# Altium schematic sheet buttons.SchDoc: Power Control Board
size A; CheckedBy: TunBra; DrawnBy: Iheb Wesleti; SheetNumber: 3; SheetTotal: 3
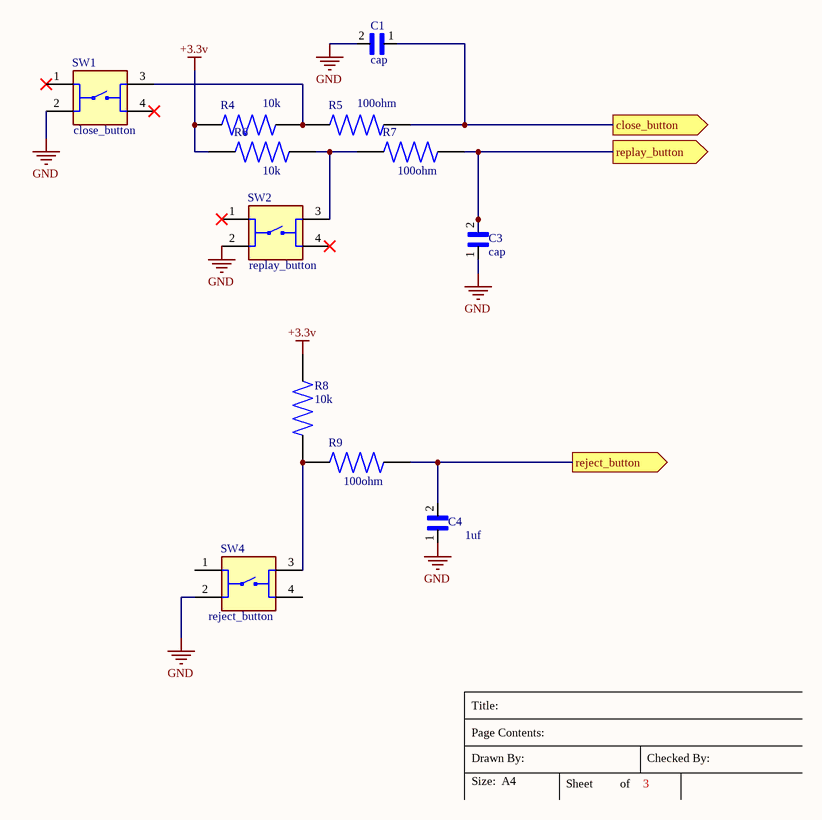
[diagram p0: buttons.SchDoc]

## Parts
C1  cap  [cap]
C3  cap  [cap]
C4  value 1uf  [cap]  (hidden comment: cap)
R4  value 10k  [resistance]  (hidden comment: resistance)
R5  value 100ohm  [resistance]  (hidden comment: resistance)
R6  value 10k  [resistance]  (hidden comment: resistance)
R7  value 100ohm  [resistance]  (hidden comment: resistance)
R8  value 10k  [resistance]  (hidden comment: resistance)
R9  value 100ohm  [resistance]  (hidden comment: resistance)
SW1  close_button  [push_button_pcb]
SW2  replay_button  [push_button_pcb]
SW4  reject_button  [push_button_pcb]

## Ports
close_button (out), reject_button (out), replay_button (out)

## Nets
+3.3v: R4.2 R6.2 R8.1
GND: C1.2 C3.1 C4.1 SW1.2 SW2.2 SW4.2
close_button: C1.1 R5.1 ; port close_button
reject_button: C4.2 R9.1 ; port reject_button
replay_button: C3.2 R7.1 ; port replay_button
NetR4_1: R4.1 R5.2 SW1.3
NetR6_1: R6.1 R7.2 SW2.3
NetR8_2: R8.2 R9.2 SW4.3

Not connected (* = marked no-connect by the designer): SW1 1* 4*; SW2 1* 4*; SW4 1 4

## Notes on the sheet
- Title:
- Size:
- Drawn By:
- Page Contents:
- A4
- Sheet
- of
- Checked By:
- 3

## Library data of the parts
C1 C3 C4 = cap: Lead Capacitor X7R_EIA_ with Capacitance: 0.10F and Rated Voltage: 1000Vdc; MF: Murata; MP: RDER73A104K5E1H03A; Price: None; SnapEDA_Link: https://www.snapeda.com/parts/RDER73A104K5E1H03A/Murata/view-part/4545952/?ref=snap; Package: Radial Murata; Availability: Unavailable
  C1 C3: Value: *
R4-R9 = resistance: MP: CBT50J5R1; MF: TE Connectivity / AMP; Price: None; Availability: In Stock; Package: Axial TE Connectivity / AMP; SnapEDA_Link: https://www.snapeda.com/parts/CBT50J5R1/TE+Connectivity+%252F+AMP/view-part/?ref=snap; Purchase-URL: https://pricing.snapeda.com/search/part/CBT50J5R1/?ref=eda; Check_prices: https://www.snapeda.com/parts/CBT50J5R1/TE+Connectivity+%252F+AMP/view-part/?ref=eda
SW1 SW2 SW4 = push_button: Switch Push Button OFF (ON) SPST Round Button 0.05A 24VDC Momentary Contact PC Pins Thru-Hole; MP: 1825910-6; MF: TE Connectivity; Value: *; Package: None; Check_prices: https://www.snapeda.com/parts/1825910-6/TE+Connectivity+ALCOSWITCH+Switches/view-part/?ref=eda; SnapEDA_Link: https://www.snapeda.com/parts/1825910-6/TE+Connectivity+ALCOSWITCH+Switches/view-part/?ref=snap; Digi-Key_Part_Number: 450-1650-ND; Purchase-URL: https://pricing.snapeda.com/search/part/1825910-6/?ref=eda